# Altium project master-010106.PrjPcb (part 1 of 5)
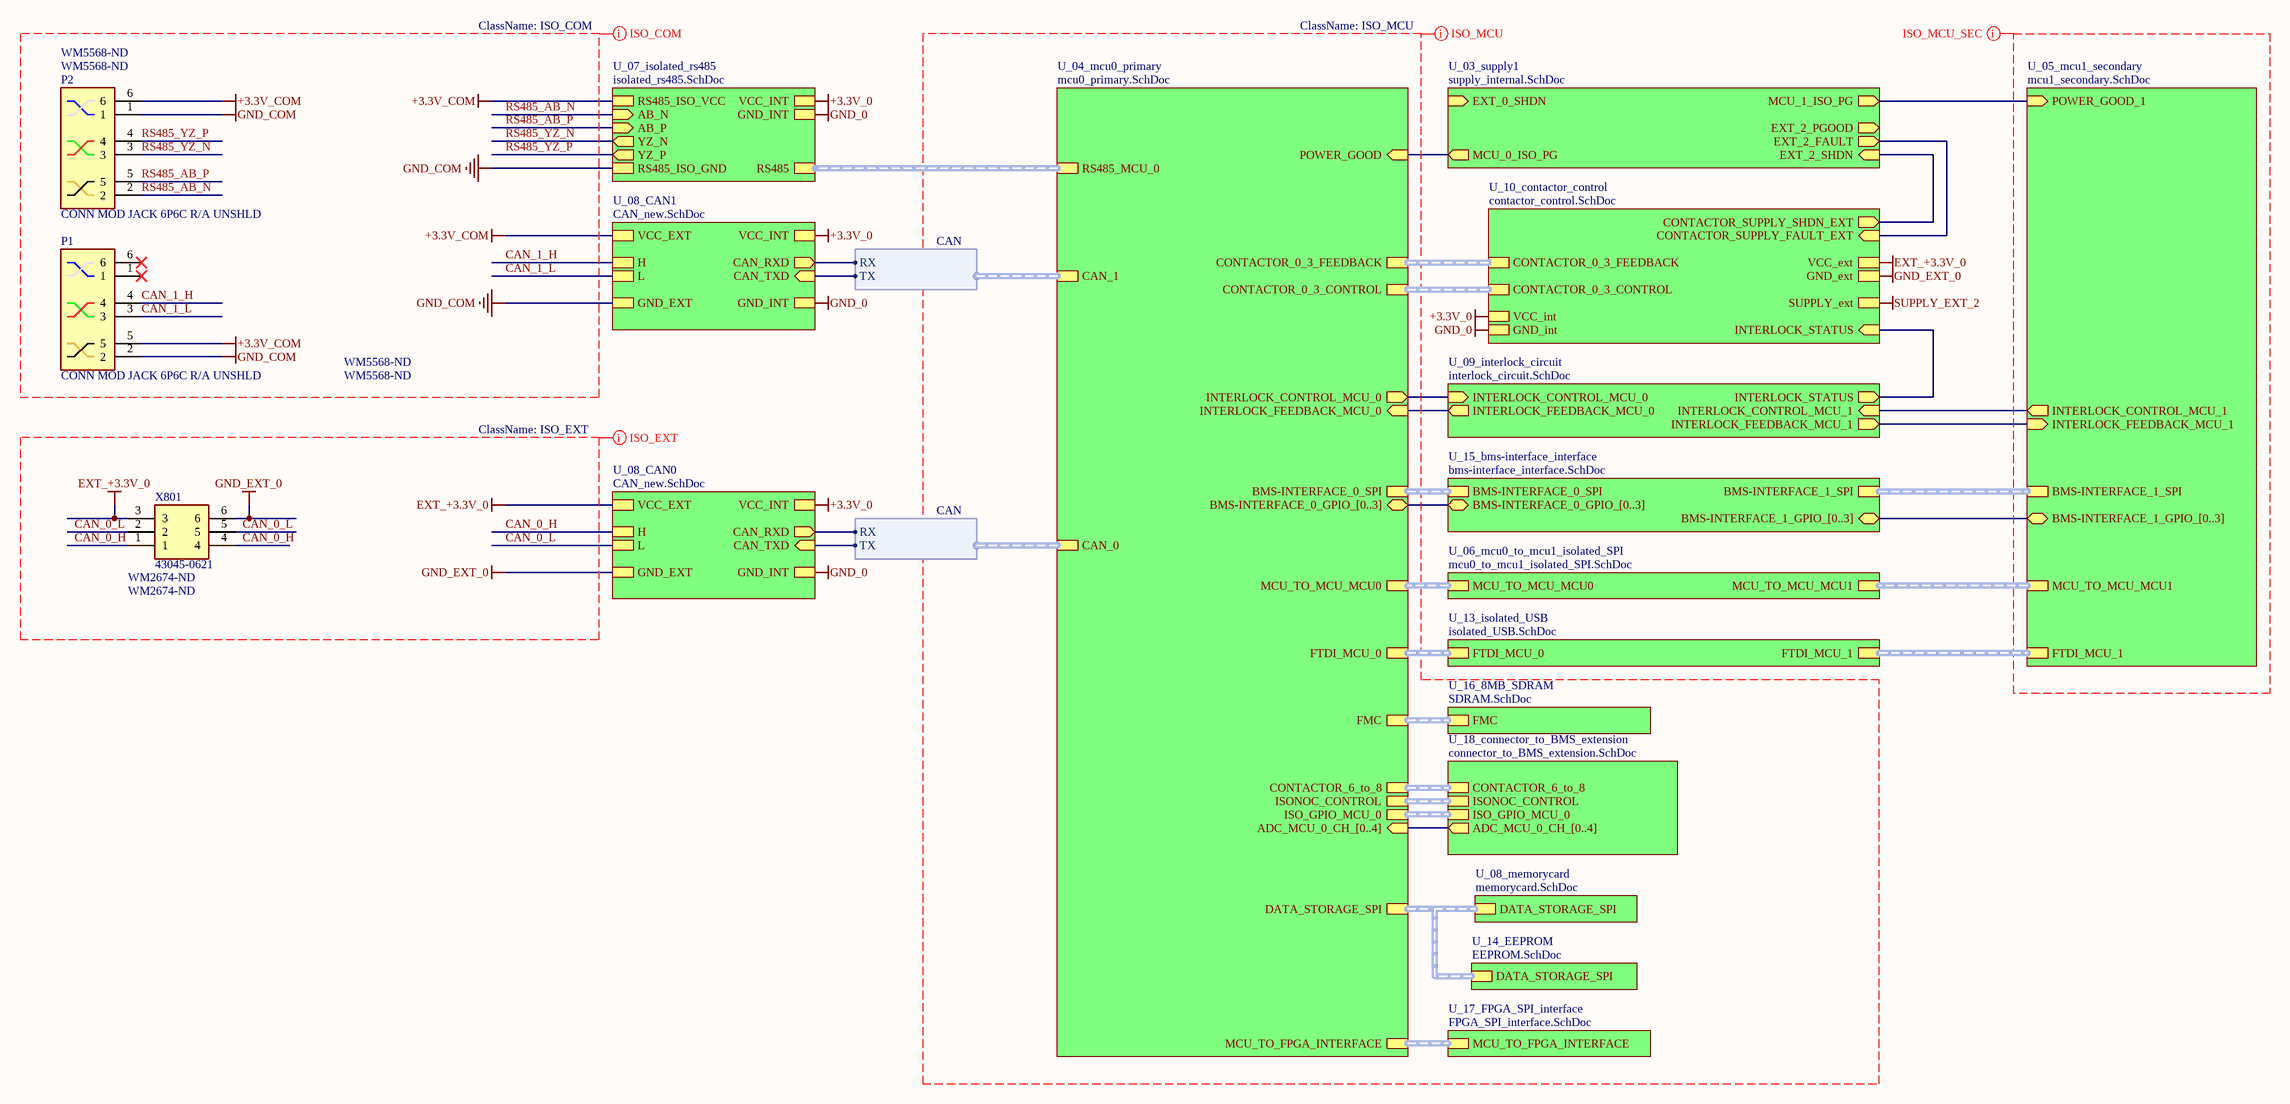
[diagram p0: hierarchy.SchDoc]
GlobalDate: 2019-07-15; GlobalLicense: Creative Commons Attribution 4.0; GlobalProject: foxBMS BMS-master; GlobalVersion: 1.0.6-1
28 sheets, 491 parts. Net scope: hierarchical (ports join the sheet entries above them; power ports are global).
Board files: master.PcbDoc, master-1X1.PcbDoc
Sheets:
  hierarchy.SchDoc
    U_17_FPGA_SPI_interface = FPGA_SPI_interface.SchDoc
    U_03_supply1 = supply_internal.SchDoc
      MCU_0_ISO = IsoDcDc-BSR033A.SchDoc
      MCU_1_ISO = IsoDcDc-BSR033A.SchDoc
      COM_EXT_ISO = isolated_dcdc_3.3to3.3.SchDoc
      MCU_0_VCC = dcdc_5v0_3v3.SchDoc
      EXT_SUPPLY_VCC = dcdc_wide_3v3.SchDoc
      MCU_1_VCC = dcdc_5v0_3v3.SchDoc
      EXT_SUPPLY = supply_external.SchDoc
    U_04_mcu0_primary = mcu0_primary.SchDoc
      U_0403_crystals = crystals.SchDoc
      U_0404_debug_LED = debug_LED.SchDoc
      U_0405_ext_bootload_activation = ext_bootload_activation.SchDoc
      U_0400_power = power.SchDoc
    U_16_8MB_SDRAM = SDRAM.SchDoc
    U_06_mcu0_to_mcu1_isolated_SPI = mcu0_to_mcu1_isolated_SPI.SchDoc
    U_05_mcu1_secondary = mcu1_secondary.SchDoc
    U_18_connector_to_BMS_extension = connector_to_BMS_extension.SchDoc
    U_09_interlock_circuit = interlock_circuit.SchDoc
    U_10_contactor_control = contactor_control.SchDoc
    U_14_EEPROM = EEPROM.SchDoc
    U_15_bms-interface_interface = bms-interface_interface.SchDoc
      Primary LTC6820 = 03_LTC6820.SchDoc
        U_0301_LTC6820_forward = 0301_LTC6820_chip.SchDoc
        U_0301_LTC6820_reverse = 0301_LTC6820_chip.SchDoc
      Secondary Galvanic Isolation = bms-slave-magnetics.SchDoc
      Secondary LTC6820 = 03_LTC6820.SchDoc
        U_0301_LTC6820_forward = 0301_LTC6820_chip.SchDoc
        U_0301_LTC6820_reverse = 0301_LTC6820_chip.SchDoc
    U_07_isolated_rs485 = isolated_rs485.SchDoc
    U_08_memorycard = memorycard.SchDoc
    U_08_CAN1 = CAN_new.SchDoc
    U_08_CAN0 = CAN_new.SchDoc
  isolated_usb_single.SchDoc

## Sheet hierarchy.SchDoc
size A2; DocumentNumber: 1; SheetNumber: 1; SheetTotal: 24; SheetDescription: Structure of Master

### Parts
P1  CONN MOD JACK 6P6C R/A UNSHLD  Supplier Part Number 1: WM5568-ND  [95501-2661]
P2  CONN MOD JACK 6P6C R/A UNSHLD  Supplier Part Number 1: WM5568-ND  [95501-2661]
X801  43045-0621  Supplier Part Number 1: WM2674-ND  [43045-0621]

### Sub-sheets
U_03_supply1 = supply_internal.SchDoc: EXT_2_FAULT (out), MCU_1_ISO_PG (out), EXT_0_SHDN (in), EXT_2_PGOOD (out), EXT_2_SHDN (in), MCU_0_ISO_PG (out)
U_04_mcu0_primary = mcu0_primary.SchDoc: MCU_TO_FPGA_INTERFACE (harness SPI), FMC (harness FMC), CAN_1 (harness CAN), CAN_0 (harness CAN), MCU_TO_MCU_MCU0 (harness SPI), FTDI_MCU_0 (harness FTDI), CONTACTOR_6_to_8 (harness CONTACTOR_6_to_8), INTERLOCK_FEEDBACK_MCU_0 (in), INTERLOCK_CONTROL_MCU_0 (out), DATA_STORAGE_SPI (harness DATA_STORAGE_SPI), CONTACTOR_0_3_CONTROL (harness CONTACTOR_0_TO_3), CONTACTOR_0_3_FEEDBACK (harness CONTACTOR_0_TO_3_FEEDBACK), BMS-INTERFACE_0_SPI (harness SPI), BMS-INTERFACE_0_GPIO_[0..3] (bidir, harness CAN), ADC_MCU_0_CH_[0..4] (in), RS485_MCU_0 (harness RS485), ISONOC_CONTROL (harness ISONOC_CONTROL), ISO_GPIO_MCU_0 (harness ISO_GPIO), POWER_GOOD (in)
U_05_mcu1_secondary = mcu1_secondary.SchDoc: INTERLOCK_FEEDBACK_MCU_1 (in), INTERLOCK_CONTROL_MCU_1 (out), FTDI_MCU_1 (harness FTDI), MCU_TO_MCU_MCU1 (harness SPI), BMS-INTERFACE_1_SPI (harness SPI), BMS-INTERFACE_1_GPIO_[0..3] (bidir), POWER_GOOD_1 (in)
U_06_mcu0_to_mcu1_isolated_SPI = mcu0_to_mcu1_isolated_SPI.SchDoc: MCU_TO_MCU_MCU0 (harness SPI), MCU_TO_MCU_MCU1 (harness SPI)
U_07_isolated_rs485 = isolated_rs485.SchDoc: RS485 (harness RS485), RS485_ISO_GND, RS485_ISO_VCC, YZ_P (out), AB_N (in), AB_P (in), YZ_N (out), VCC_INT, GND_INT
U_08_CAN0 = CAN_new.SchDoc: VCC_EXT, H, L, GND_EXT, CAN_TXD (in), CAN_RXD (out), GND_INT, VCC_INT
U_08_CAN1 = CAN_new.SchDoc: VCC_EXT, H, L, GND_EXT, CAN_TXD (in), CAN_RXD (out), GND_INT, VCC_INT
U_08_memorycard = memorycard.SchDoc: DATA_STORAGE_SPI (harness DATA_STORAGE_SPI)
U_09_interlock_circuit = interlock_circuit.SchDoc: INTERLOCK_CONTROL_MCU_1 (in), INTERLOCK_FEEDBACK_MCU_0 (out), INTERLOCK_FEEDBACK_MCU_1 (out), INTERLOCK_CONTROL_MCU_0 (in), INTERLOCK_STATUS (out)
U_10_contactor_control = contactor_control.SchDoc: SUPPLY_ext, GND_ext, GND_int, VCC_int, VCC_ext, CONTACTOR_0_3_CONTROL (harness CONTACTOR_0_TO_3), CONTACTOR_0_3_FEEDBACK (harness CONTACTOR_0_TO_3_FEEDBACK), CONTACTOR_SUPPLY_FAULT_EXT (in), CONTACTOR_SUPPLY_SHDN_EXT (out), INTERLOCK_STATUS (in)
U_13_isolated_USB = isolated_USB.SchDoc (file not in this document): FTDI_MCU_0 (harness FTDI), FTDI_MCU_1 (harness FTDI)
U_14_EEPROM = EEPROM.SchDoc: DATA_STORAGE_SPI (harness DATA_STORAGE_SPI)
U_15_bms-interface_interface = bms-interface_interface.SchDoc: BMS-INTERFACE_0_SPI (harness SPI), BMS-INTERFACE_1_SPI (harness SPI), BMS-INTERFACE_0_GPIO_[0..3] (bidir), BMS-INTERFACE_1_GPIO_[0..3] (bidir)
U_16_8MB_SDRAM = SDRAM.SchDoc: FMC (harness FMC)
U_17_FPGA_SPI_interface = FPGA_SPI_interface.SchDoc: MCU_TO_FPGA_INTERFACE (harness SPI)
U_18_connector_to_BMS_extension = connector_to_BMS_extension.SchDoc: CONTACTOR_6_to_8 (harness CONTACTOR_6_to_8), ADC_MCU_0_CH_[0..4] (out), ISONOC_CONTROL (harness ISONOC_CONTROL), ISO_GPIO_MCU_0 (harness ISO_GPIO)

### Harnesses
CAN: RX, TX

### Nets
+3.3V_0: sheet U_10_contactor_control/VCC_int, sheet U_07_isolated_rs485/VCC_INT, sheet U_08_CAN1/VCC_INT, sheet U_08_CAN0/VCC_INT
+3.3V_COM: P1.5 P2.6 X801.3 ; sheet U_10_contactor_control/VCC_ext, sheet U_07_isolated_rs485/RS485_ISO_VCC, sheet U_08_CAN1/VCC_EXT, sheet U_08_CAN0/VCC_EXT  [also labelled EXT_+3.3V_0]
GND_0: P1.2 P2.1 X801.6 ; sheet U_10_contactor_control/GND_ext, sheet U_10_contactor_control/GND_int, sheet U_07_isolated_rs485/RS485_ISO_GND, sheet U_07_isolated_rs485/GND_INT, sheet U_08_CAN1/GND_EXT, sheet U_08_CAN1/GND_INT, sheet U_08_CAN0/GND_EXT, sheet U_08_CAN0/GND_INT  [also labelled GND_COM, GND_EXT_0]  [project net GND]
CAN_0_H: X801.1 X801.4 ; sheet U_08_CAN0/H
CAN_0_L: X801.2 X801.5 ; sheet U_08_CAN0/L
CAN_0_RX: sheet U_08_CAN0/CAN_RXD, sheet U_04_mcu0_primary/CAN_0.RX
CAN_0_TX: sheet U_08_CAN0/CAN_TXD, sheet U_04_mcu0_primary/CAN_0.TX
CAN_1_H: P1.4 ; sheet U_08_CAN1/H
CAN_1_L: P1.3 ; sheet U_08_CAN1/L
CAN_1_RX: sheet U_08_CAN1/CAN_RXD, sheet U_04_mcu0_primary/CAN_1.RX
CAN_1_TX: sheet U_08_CAN1/CAN_TXD, sheet U_04_mcu0_primary/CAN_1.TX
CONTACTOR_SUPPLY_FAULT_EXT: sheet U_03_supply1/EXT_2_FAULT, sheet U_10_contactor_control/CONTACTOR_SUPPLY_FAULT_EXT
CONTACTOR_SUPPLY_SHDN_EXT: sheet U_03_supply1/EXT_2_SHDN, sheet U_10_contactor_control/CONTACTOR_SUPPLY_SHDN_EXT
INTERLOCK_CONTROL_MCU_0: sheet U_04_mcu0_primary/INTERLOCK_CONTROL_MCU_0, sheet U_09_interlock_circuit/INTERLOCK_CONTROL_MCU_0
INTERLOCK_CONTROL_MCU_1: sheet U_05_mcu1_secondary/INTERLOCK_CONTROL_MCU_1, sheet U_09_interlock_circuit/INTERLOCK_CONTROL_MCU_1
INTERLOCK_FEEDBACK_MCU_0: sheet U_04_mcu0_primary/INTERLOCK_FEEDBACK_MCU_0, sheet U_09_interlock_circuit/INTERLOCK_FEEDBACK_MCU_0
INTERLOCK_FEEDBACK_MCU_1: sheet U_05_mcu1_secondary/INTERLOCK_FEEDBACK_MCU_1, sheet U_09_interlock_circuit/INTERLOCK_FEEDBACK_MCU_1
INTERLOCK_STATUS: sheet U_09_interlock_circuit/INTERLOCK_STATUS, sheet U_10_contactor_control/INTERLOCK_STATUS
MCU_0_NRESET: sheet U_03_supply1/MCU_0_ISO_PG, sheet U_04_mcu0_primary/POWER_GOOD
MCU_1_NRESET: sheet U_03_supply1/MCU_1_ISO_PG, sheet U_05_mcu1_secondary/POWER_GOOD_1
RS485_AB_N: P2.2 ; sheet U_07_isolated_rs485/AB_N  [project net ABEXT_N]
RS485_AB_P: P2.5 ; sheet U_07_isolated_rs485/AB_P  [project net ABEXT_P]
RS485_YZ_N: P2.3 ; sheet U_07_isolated_rs485/YZ_N
RS485_YZ_P: P2.4 ; sheet U_07_isolated_rs485/YZ_P

Not connected (* = marked no-connect by the designer): P1 1* 6*

### Buses and harness runs
bus sheet U_04_mcu0_primary/ADC_MCU_0_CH_[0..4] = sheet U_18_connector_to_BMS_extension/ADC_MCU_0_CH_[0..4]
bus sheet U_05_mcu1_secondary/BMS-INTERFACE_1_GPIO_[0..3] = sheet U_15_bms-interface_interface/BMS-INTERFACE_1_GPIO_[0..3]
harness sheet U_04_mcu0_primary/BMS-INTERFACE_0_SPI = sheet U_15_bms-interface_interface/BMS-INTERFACE_0_SPI
harness sheet U_04_mcu0_primary/CONTACTOR_0_3_CONTROL = sheet U_10_contactor_control/CONTACTOR_0_3_CONTROL
harness sheet U_04_mcu0_primary/CONTACTOR_0_3_FEEDBACK = sheet U_10_contactor_control/CONTACTOR_0_3_FEEDBACK
harness sheet U_04_mcu0_primary/CONTACTOR_6_to_8 = sheet U_18_connector_to_BMS_extension/CONTACTOR_6_to_8
harness sheet U_04_mcu0_primary/DATA_STORAGE_SPI = sheet U_08_memorycard/DATA_STORAGE_SPI = sheet U_14_EEPROM/DATA_STORAGE_SPI
harness sheet U_04_mcu0_primary/FMC = sheet U_16_8MB_SDRAM/FMC
harness sheet U_04_mcu0_primary/FTDI_MCU_0 = sheet U_13_isolated_USB/FTDI_MCU_0
harness sheet U_04_mcu0_primary/ISO_GPIO_MCU_0 = sheet U_18_connector_to_BMS_extension/ISO_GPIO_MCU_0
harness sheet U_04_mcu0_primary/ISONOC_CONTROL = sheet U_18_connector_to_BMS_extension/ISONOC_CONTROL
harness sheet U_04_mcu0_primary/MCU_TO_FPGA_INTERFACE = sheet U_17_FPGA_SPI_interface/MCU_TO_FPGA_INTERFACE
harness sheet U_04_mcu0_primary/MCU_TO_MCU_MCU0 = sheet U_06_mcu0_to_mcu1_isolated_SPI/MCU_TO_MCU_MCU0
harness sheet U_04_mcu0_primary/RS485_MCU_0 = sheet U_07_isolated_rs485/RS485
harness sheet U_05_mcu1_secondary/BMS-INTERFACE_1_SPI = sheet U_15_bms-interface_interface/BMS-INTERFACE_1_SPI
harness sheet U_05_mcu1_secondary/FTDI_MCU_1 = sheet U_13_isolated_USB/FTDI_MCU_1
harness sheet U_05_mcu1_secondary/MCU_TO_MCU_MCU1 = sheet U_06_mcu0_to_mcu1_isolated_SPI/MCU_TO_MCU_MCU1

### Layout directives
net class ISO_MCU: +3.3V_0, EXT_+3.3V_0, GND_0, GND_EXT_0, SUPPLY_EXT_2
net class ISO_MCU_SEC: (no net found under the mark)
net class ISO_COM: +3.3V_COM, CAN_1_H, CAN_1_L, GND_COM, RS485_AB_N, RS485_AB_P, RS485_YZ_N, RS485_YZ_P
net class ISO_EXT: CAN_0_H, CAN_0_L, EXT_+3.3V_0, GND_EXT_0

### Notes on the sheet
- Title
- Size:
- Date:
- File:
- A2
- Number:
- Time:
- Revision:
- Sheet
- of

### Library data of the parts
P1 P2 = 95501-2661: Jack Modular Connector 6p6c (RJ9, RJ10, RJ22) 90° Angle (Right) Unshielded Cat3; Manufacturer_Name: Molex; Manufacturer_Part_Number: 95501-2441; Allied_Number: 70372436; Datasheet Link: http://www.molex.com/webdocs/datasheets/pdf/en-us/0955012441_MODULAR_JACKS_PLUG.pdf; Mouser Part Number: 538-95501-2441; Mouser Price/Stock: https://www.mouser.com/Search/Refine.aspx?Keyword=538-95501-2441; RS Part Number: 2400913; RS Price/Stock: https://uk.rs-online.com/web/p/products/2400913; Allied Price/Stock: http://www.alliedelec.com/molex-incorporated-95501-2441/70372436/; Supplier 1: Digi-Key; Supplier 2: Digi-Key; Supplier Part Number 2: WM5568-ND
X801 = 43045-0621: Micro-Fit 3.0 Right Angle Header, 3.00mm Pitch, Dual Row, 6 Circuits, with Snap-in Plastic Peg PCB Lock, Tin, Glow Wire Capable, Black, 43045-0621; Manufacturer_Name: Molex; Part Name: MicroFit; Circuits: 6; Datasheet Link: http://www.molex.com/webdocs/datasheets/pdf/en-us//0430450621_PCB_HEADERS.pdf; Height: 8mm; Manufacturer_Part_Number: 43045-0621; Mouser Part Number: 538-43045-0621; Mouser Price/Stock: https://www.mouser.com/Search/Refine.aspx?Keyword=538-43045-0621; RS Part Number: 6700380; RS Price/Stock: https://uk.rs-online.com/web/p/products/6700380; Supplier 1: Digi-Key; Supplier 2: Digi-Key; Supplier Part Number 2: WM2674-ND

## Sheet FPGA_SPI_interface.SchDoc: foxBMS BMS-Master
size A3; DocumentNumber: 23; SheetNumber: 23; SheetTotal: 24; Author: Fraunhofer IISB foxBMS Team; REL-DATE: 2017-05-16; VERSION: 1.0.2; SheetDescription: FPGA SPI Interface up to 45MHz
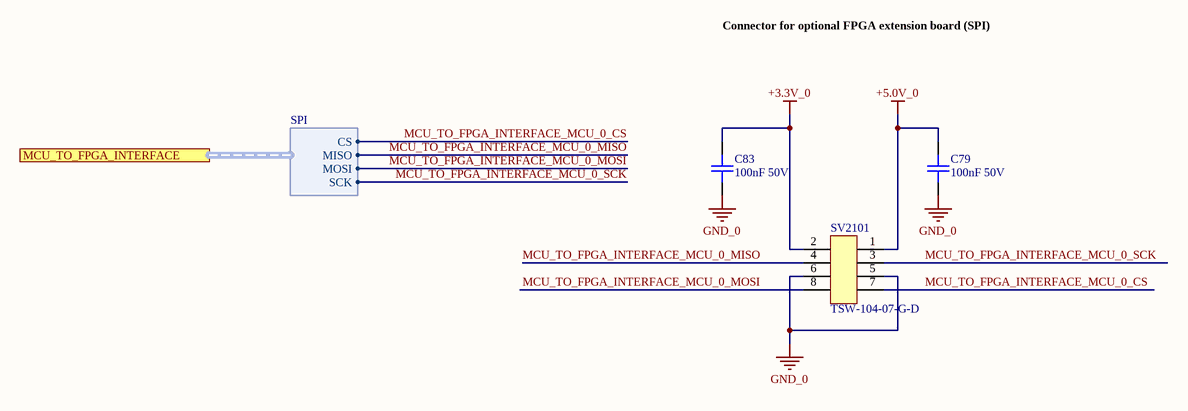
[diagram p1: FPGA_SPI_interface.SchDoc]

### Parts
C79  100nF 50V  [0603C]
C83  100nF 50V  [0603C]
SV2101  TSW-104-07-G-D  [Pinheader_2.54_2x4]

### Ports
MCU_TO_FPGA_INTERFACE (harness SPI)

### Harnesses
SPI: CS, MISO, MOSI, SCK

### Nets
+3.3V_0: C83.2 SV2101.2
+5.0V_0: C79.1 SV2101.1
GND_0: C79.2 C83.1 SV2101.5 SV2101.6  [project net GND]
MCU_TO_FPGA_INTERFACE_MCU_0_CS: SV2101.7 ; port MCU_TO_FPGA_INTERFACE.CS
MCU_TO_FPGA_INTERFACE_MCU_0_MISO: SV2101.4 ; port MCU_TO_FPGA_INTERFACE.MISO
MCU_TO_FPGA_INTERFACE_MCU_0_MOSI: SV2101.8 ; port MCU_TO_FPGA_INTERFACE.MOSI
MCU_TO_FPGA_INTERFACE_MCU_0_SCK: SV2101.3 ; port MCU_TO_FPGA_INTERFACE.SCK

### Notes on the sheet
- Connector for optional FPGA extension board (SPI)
- Fraunhofer IISB
- Schottkystr. 10
- developed by:
- 91058 Erlangen
- Germany
- Author
- Project
- License
- Description
- File
- Version
- Release Date
- Sheet
- www.foxbms.org
- www.iisb.fraunhofer.de
- foxBMS Team
- /

### Library data of the parts
C79 C83 = gen_C_ceramic_100n_50V_X7R_0603: Ceramic, 100nF, ±10%, 50V, X7R, –55 to 125°C, 0603 (1608),RoHS, Automotive; Part Number: GCJ188R71H104KA12; Manufacturer: Murata; Capacitance: 100n; Case EIA: 0603; Case Metric: 1608; PnP Package: C_0603_10; PnP Value: 100nF/50V/X7R; PnP equipped: x; Automotive Qualified: True; Rated Voltage: 50V; Dielectric: X7R; Supplier 1: Digi-Key; Supplier Part Number 1: 490-5798-1-ND; Height - Seated (Max): 0.8mm; Mounting Type: SurfaceMount,MLCC; Operating Temperature: –55 to 125°C; Series: GCJ; Tolerance: ±10%; Manufacturer_Part_Number: GCJ188R71H104KA12
SV2101 = samtec_TSW-104-07-G-D: Board-To-Board Connector, Vertical, 2.54 mm, 8 Contacts, Header, TSW Series, Through Hole, 2 Rows; Manufacturer: Samtec; Circuits: 8; Rated Voltage: 500V AC mated with SSW; Automotive Qualified: False; Part Number: TSW-104-07-G-D; Part Name: TSW-104-07-G-D; Operating Temperature: -55°C - +125°C; ComponentLink1Description: Datasheet; ComponentLink1URL: http://www.farnell.com/datasheets/1992055.pdf; Supplier 1: Farnell; Supplier Part Number 1: 2025250; System: Connector

## Sheet supply_internal.SchDoc: foxBMS BMS-Master
size A3; DocumentNumber: 3; SheetNumber: 3; SheetTotal: 24; Author: Fraunhofer IISB foxBMS Team; REL-DATE: 2017-05-16; VERSION: 1.0.2; SheetDescription: Supply for MCU1 and peripherals
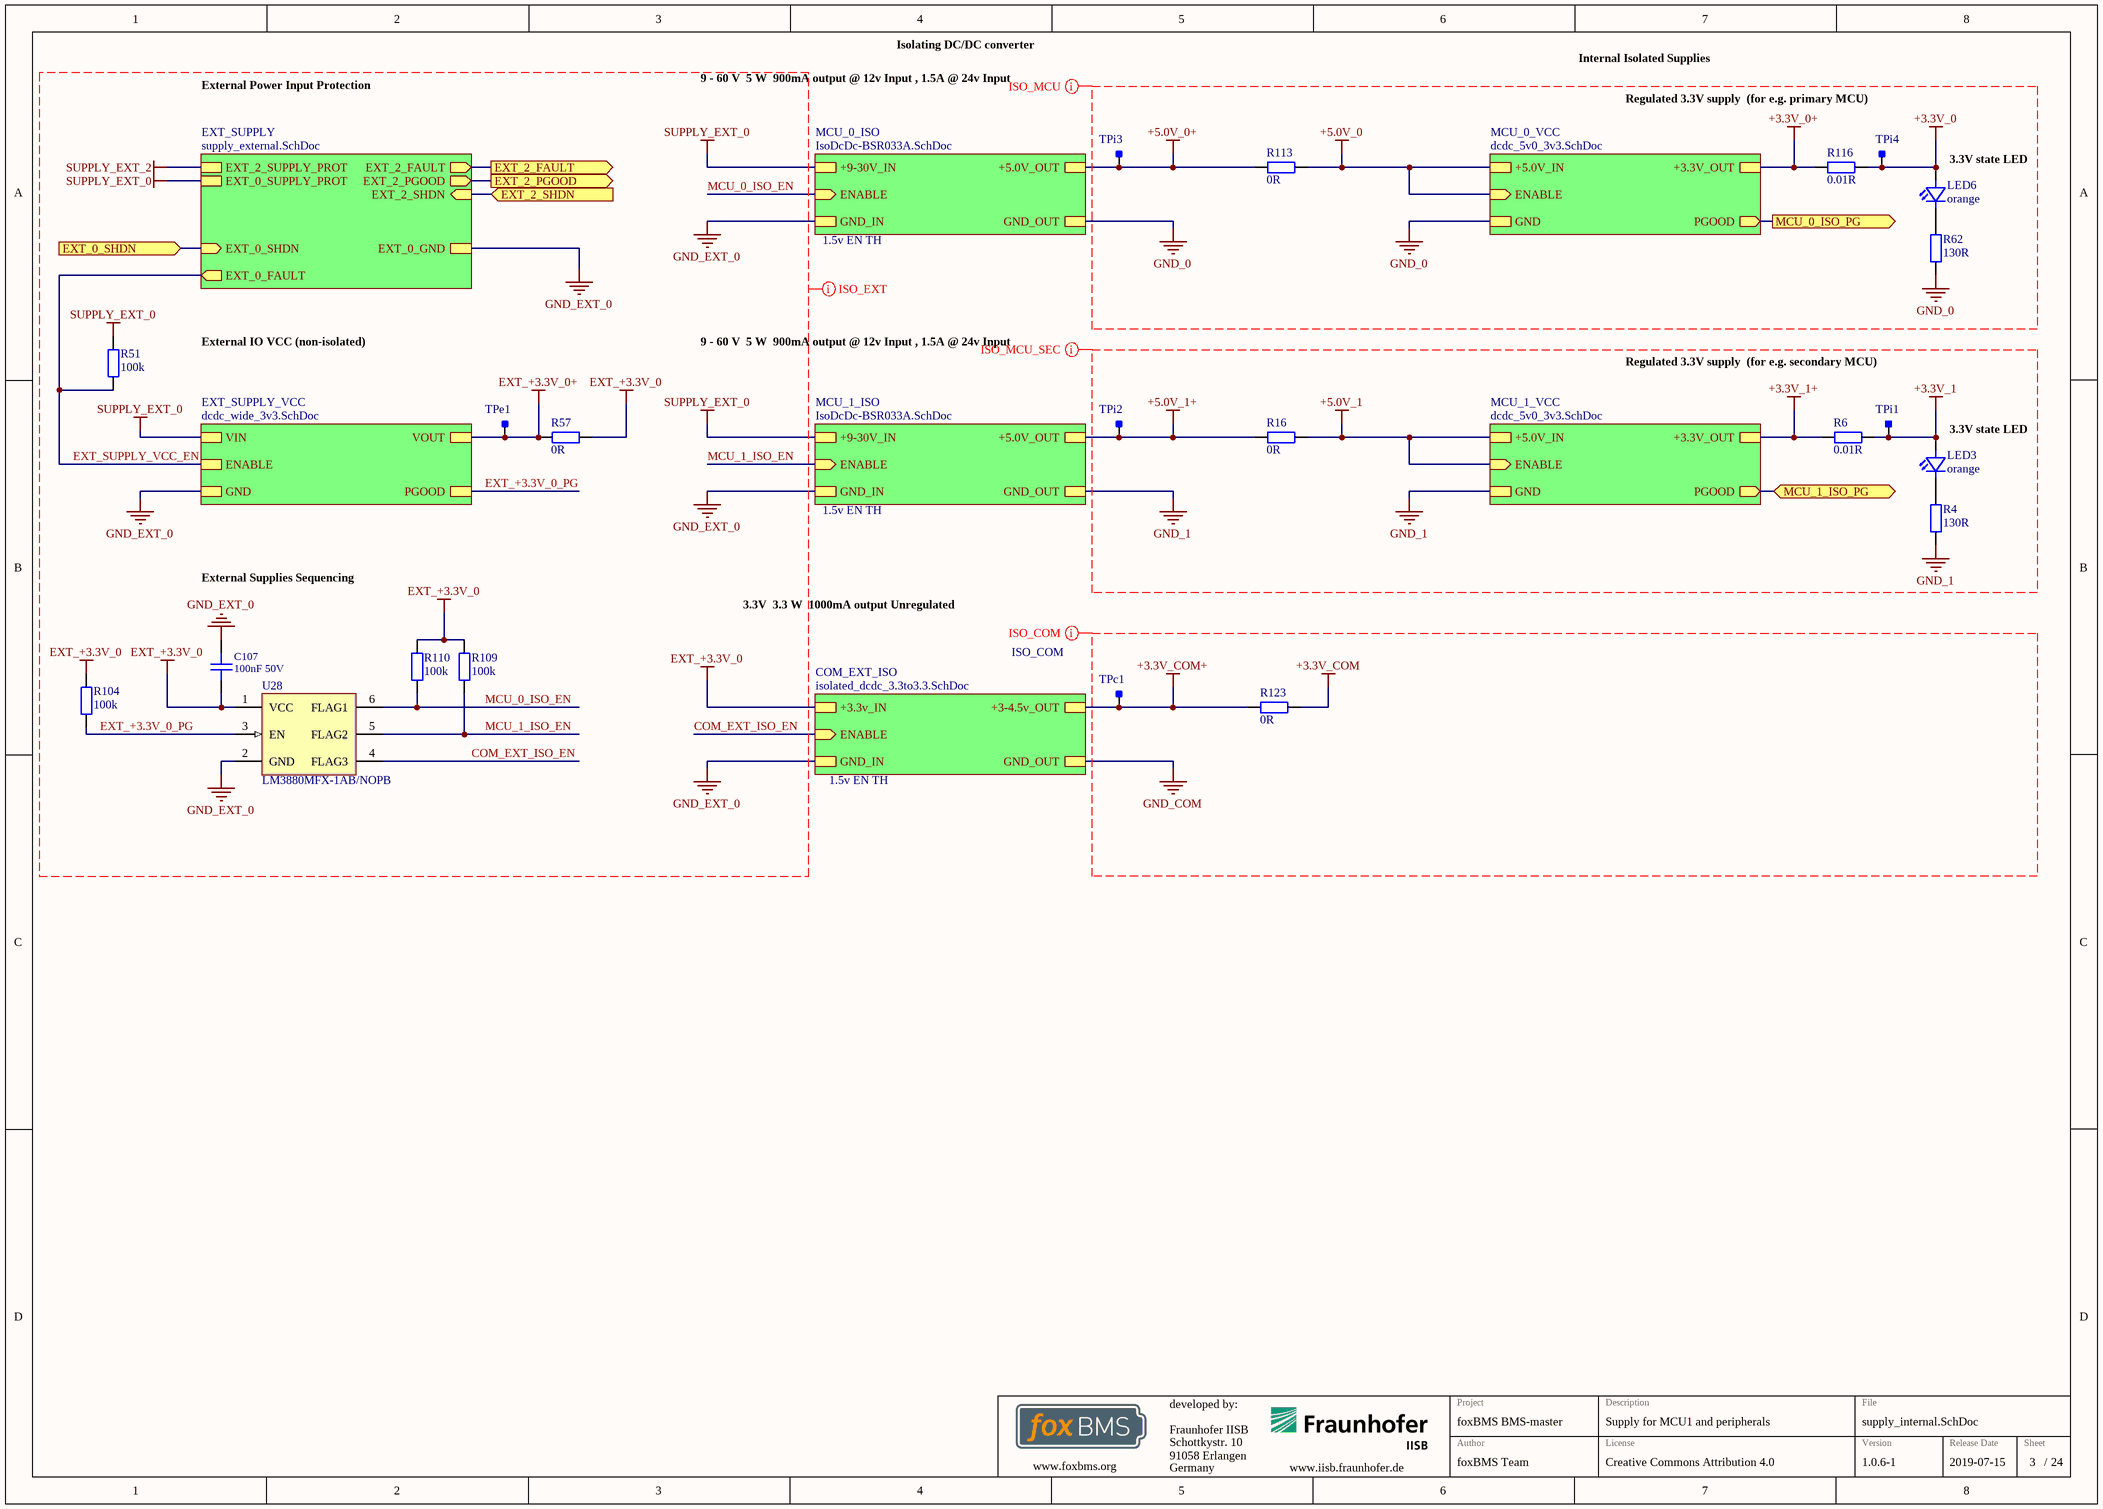
[diagram p2: supply_internal.SchDoc]

### Parts
(Parts that share a designator on the sheet are numbered #1, #2 ... from top to bottom, then left to right.)
C107  100nF 50V  [0603C]
LED3  orange  [LEDC1608X07N]
LED6  orange  [LEDC1608X07N]
R4#1  130R  [0603R]
R6  0.01R  [0805R]
R16  0R  [0805R]
R51#1  100k  [0402R]
R57  0R  [0805R]
R62#1  130R  [0603R]
R104  100k  [0603R]
R109  100k  [0603R]
R110  100k  [0603R]
R113  0R  [0805R]
R116  0.01R  [0805R]
R123  0R  [0805R]
TPc1  Testpoint_Square  [Testpoint_S1]  (value not drawn)  (no BOM)
TPe1  Testpoint_Square  [Testpoint_S1]  (value not drawn)  (no BOM)
TPi1  Testpoint_Square  [Testpoint_S1]  (value not drawn)  (no BOM)
TPi2  Testpoint_Square  [Testpoint_S1]  (value not drawn)  (no BOM)
TPi3  Testpoint_Square  [Testpoint_S1]  (value not drawn)  (no BOM)
TPi4  Testpoint_Square  [Testpoint_S1]  (value not drawn)  (no BOM)
U28  LM3880MFX-1AB/NOPB  [MF06A_N]

### Sub-sheets
COM_EXT_ISO = isolated_dcdc_3.3to3.3.SchDoc: ENABLE (in), +3.3v_IN, GND_OUT, +3-4.5v_OUT, GND_IN
EXT_SUPPLY = supply_external.SchDoc: EXT_2_FAULT (out), EXT_2_PGOOD (out), EXT_0_FAULT (out), EXT_2_SHDN (in), EXT_0_SHDN (in), EXT_2_SUPPLY_PROT, EXT_0_SUPPLY_PROT, EXT_0_GND
EXT_SUPPLY_VCC = dcdc_wide_3v3.SchDoc: VIN, ENABLE, PGOOD, GND, VOUT
MCU_0_ISO = IsoDcDc-BSR033A.SchDoc: ENABLE (in), +9-30V_IN, +5.0V_OUT, GND_OUT, GND_IN
MCU_0_VCC = dcdc_5v0_3v3.SchDoc: +5.0V_IN, ENABLE (in), PGOOD (out), GND, +3.3V_OUT
MCU_1_ISO = IsoDcDc-BSR033A.SchDoc: ENABLE (in), +9-30V_IN, +5.0V_OUT, GND_OUT, GND_IN
MCU_1_VCC = dcdc_5v0_3v3.SchDoc: +5.0V_IN, ENABLE (in), PGOOD (out), GND, +3.3V_OUT

### Ports
EXT_0_SHDN (in), EXT_2_FAULT (out), EXT_2_PGOOD (out), EXT_2_SHDN (in), MCU_0_ISO_PG (out), MCU_1_ISO_PG (bidir)

### Nets
+3.3V_0: LED3.2(A) LED6.2(A) R6.1 R116.1 TPi1.1 TPi4.1  [also labelled +3.3V_1]
+3.3V_0+: R116.2 ; sheet MCU_0_VCC/+3.3V_OUT
+3.3V_1+: R6.2 ; sheet MCU_1_VCC/+3.3V_OUT
+3.3V_COM: C107.2 R57.1 R104.2 R109.2 R110.2 R123.1 U28.1(VCC) ; sheet COM_EXT_ISO/+3.3v_IN  [also labelled EXT_+3.3V_0]
+3.3V_COM+: R123.2 TPc1.1 ; sheet COM_EXT_ISO/+3-4.5v_OUT  [project net +3-4.5v_out]
+5.0V_0: R113.1 ; sheet MCU_0_VCC/+5.0V_IN, sheet MCU_0_VCC/ENABLE
+5.0V_0+: R16.2 R113.2 TPi2.1 TPi3.1 ; sheet MCU_0_ISO/+5.0V_OUT, sheet MCU_1_ISO/+5.0V_OUT  [also labelled +5.0V_1+]
+5.0V_1: R16.1 ; sheet MCU_1_VCC/+5.0V_IN, sheet MCU_1_VCC/ENABLE
EXT_+3.3V_0+: R57.2 TPe1.1 ; sheet EXT_SUPPLY_VCC/VOUT
GND_0: C107.1 R4#1.2 R62#1.1 U28.2(GND) ; sheet MCU_0_ISO/GND_OUT, sheet MCU_0_ISO/GND_IN, sheet MCU_1_ISO/GND_OUT, sheet MCU_1_ISO/GND_IN, sheet COM_EXT_ISO/GND_OUT, sheet COM_EXT_ISO/GND_IN, sheet MCU_0_VCC/GND, sheet EXT_SUPPLY_VCC/GND, sheet MCU_1_VCC/GND, sheet EXT_SUPPLY/EXT_0_GND  [also labelled GND_1, GND_COM, GND_EXT_0]  [project net GND]
SUPPLY_EXT_0: R51#1.2 ; sheet MCU_0_ISO/+9-30V_IN, sheet MCU_1_ISO/+9-30V_IN, sheet EXT_SUPPLY_VCC/VIN, sheet EXT_SUPPLY/EXT_0_SUPPLY_PROT  [project net +9-30V_IN]
COM_EXT_ISO_EN: U28.4(FLAG3) ; sheet COM_EXT_ISO/ENABLE
CONTACTOR_SUPPLY_FAULT_EXT: port EXT_2_FAULT, sheet EXT_SUPPLY/EXT_2_FAULT
CONTACTOR_SUPPLY_SHDN_EXT: port EXT_2_SHDN, sheet EXT_SUPPLY/EXT_2_SHDN
EXT_0.SHDN: port EXT_0_SHDN, sheet EXT_SUPPLY/EXT_0_SHDN
EXT_2.PGOOD: port EXT_2_PGOOD, sheet EXT_SUPPLY/EXT_2_PGOOD
EXT_+3.3V_0_PG: R104.1 U28.3(EN) ; sheet EXT_SUPPLY_VCC/PGOOD
EXT_SUPPLY_VCC_EN: R51#1.1 ; sheet EXT_SUPPLY_VCC/ENABLE, sheet EXT_SUPPLY/EXT_0_FAULT  [project net EXT_0.FAULT]
MCU_0_ISO_EN: R110.1 U28.6(FLAG1) ; sheet MCU_0_ISO/ENABLE
MCU_0_NRESET: port MCU_0_ISO_PG, sheet MCU_0_VCC/PGOOD
MCU_1_ISO_EN: R109.1 U28.5(FLAG2) ; sheet MCU_1_ISO/ENABLE
MCU_1_NRESET: port MCU_1_ISO_PG, sheet MCU_1_VCC/PGOOD
NetLED3_1: LED3.1(C) R4#1.1
NetLED6_1: LED6.1(C) R62#1.2

### Layout directives
net class ISO_MCU_SEC: +3.3V_1, +3.3V_1+, +5.0V_1, +5.0V_1+, GND_1
net class ISO_EXT: COM_EXT_ISO_EN, EXT_+3.3V_0, EXT_+3.3V_0+, EXT_+3.3V_0_PG, EXT_SUPPLY_VCC_EN, GND_EXT_0, MCU_0_ISO_EN, MCU_1_ISO_EN, SUPPLY_EXT_0, SUPPLY_EXT_2
net class ISO_MCU: +3.3V_0, +3.3V_0+, +5.0V_0, +5.0V_0+, GND_0
net class ISO_COM: +3.3V_COM, +3.3V_COM+, GND_COM

### Notes on the sheet
- Isolating DC/DC converter
- External Power Input Protection
- 9 - 60 V
  5 W
  900mA output @ 12v Input , 1.5A @ 24v Input
- Internal Isolated Supplies
- Regulated 3.3V supply
  (for e.g. primary MCU)
- (near LED6) 3.3V state LED
- 1.5v EN TH
- External IO VCC (non-isolated)
- Regulated 3.3V supply
  (for e.g. secondary MCU)
- (near LED3) 3.3V state LED
- External Supplies Sequencing
- 3.3V
  3.3 W
  1000mA output Unregulated
- Fraunhofer IISB
- Schottkystr. 10
- developed by:
- 91058 Erlangen
- Germany
- Author
- Project
- License
- Description
- File
- Version
- Release Date
- Sheet
- www.foxbms.org
- www.iisb.fraunhofer.de
- foxBMS Team
- /

### Library data of the parts
C107 = gen_C_ceramic_100n_50V_X7R_0603: Ceramic, 100nF, ±10%, 50V, X7R, –55 to 125°C, 0603 (1608),RoHS, Automotive; Part Number: GCJ188R71H104KA12; Manufacturer: Murata; Capacitance: 100n; Case EIA: 0603; Case Metric: 1608; Automotive Qualified: True; PnP Package: C_0603_10; PnP Value: 100nF/50V/X7R; Dielectric: X7R; Rated Voltage: 50V; Height - Seated (Max): 0.8mm; Mounting Type: SurfaceMount,MLCC; Operating Temperature: –55 to 125°C; Series: GCJ; Tolerance: ±10%; Manufacturer_Part_Number: GCJ188R71H104KA12; Supplier 1: Digi-Key; Supplier Part Number 1: 490-5798-1-ND
LED3 LED6 = gen_LED_0603_orange: LED; Breakdown Voltage: 5V; Continuous Forward Current: 20mA; Forward Voltage @ 20mA: 2.2V; Automotive Qualified: False; Case EIA: 0603; Case Metric: 1608; Part Number: gen_LED_0603_orange; Color: orange; PnP Package: LED_0603; Supplier 1: Farnell; Supplier Part Number 1: 2099222
R4#1 R62#1 = gen_R_130R_0603: SMD Resistor 130R 0603; Tolerance: 1%; Power: 0.1W; Case EIA: 0603; Case Metric: 1608; Maximum Working Voltage: 75V; PnP Package: R_0603; Automotive Qualified: False; Part Number: gen_R_130R_0603; Operating Temperature: -55°C - +155°C; Resistance: 130R; Series: E24, E96; PnP Value: 130R; Supplier 1: Farnell; Supplier Part Number 1: 2379959
R6 R116 = gen_R_0.01R_0805: SMD Resistor 10m 0805; Case EIA: 0805; Case Metric: 2012; PnP Package: R_0603; Operating Temperature: -55°C - +155°C; PnP Value: 0.01R; Part Number: gen_R_0.01R_0805
R16 R57 R113 R123 = gen_R_0.01R_0805: SMD Resistor 10m 0805; Case EIA: 0805; Case Metric: 2012; PnP Package: R_0603; PnP Value: 0.01R; Operating Temperature: -55°C - +155°C; Part Number: gen_R_0.01R_0805
R51#1 = gen_R_100k_0402: SMD Resistor 100k 0402; Case EIA: 0402; Case Metric: 1005; PnP Package: R_0402; Automotive Qualified: False; PnP Value: 100k; Operating Temperature: -55°C - +155°C; Part Number: gen_R_100k_0402
R104 R109 R110 = gen_R_100k_0603: SMD Resistor 100k 0603; Case EIA: 0603; Case Metric: 1608; PnP Package: R_0603; Automotive Qualified: False; PnP Value: 100k; Operating Temperature: -55°C - +155°C; Part Number: gen_R_100k_0603
TPc1 TPe1 TPi1-TPi4 = Testpoint_Square: Testpoint, square; Part Number: Testpoint_Square
U28 = CMP-0063-01010-1: Power Sequencer, 6-pin SOT-23, Pb-Free; Manufacturer: National Semiconductor; CompType: MiscPower; PowerWise: N; PackageTopMarking: F21A*XTT; DatasheetVersion: May-2008; PinCount: 6; Code_JEDEC: MO-178-AB; PackageReference: MF06A; Code_IPC: SOT26A-6; RoHS: Y; PackageDescription: Molded SOT-23, .115 x .063 x .040in Body, 6 Lead, .0375in in Pitch; PackageVersion: revC, Sep-2005

## Sheet IsoDcDc-BSR033A.SchDoc: LM5180EVM-S05 Buck Converter Schematic
size 431 x 279 mm; Date: Not shown in title block; ApprovedBy: Not shown in title block; CheckedBy: Not shown in title block; Author: Not shown in title block; CompanyName: Not shown in title block; DrawnBy: K Nielson; Engineer: Not shown in title block; Organization: Not shown in title block; Address1: Not shown in title block; Address2: Not shown in title block; Address3: Not shown in title block; Address4: Not shown in title block; DocumentNumber: 1; Revision: Use project parameter SCH_Rev; SheetNumber: 1; SheetTotal: 2; PageSetup: Record=PageOptions|CenterHorizontal=True|CenterVertical=True|PrintScale=1.00|XCorrection=1.00|YCorrection=1.00|PrintKind=0|BorderSize=5000000|LeftOffset=0|BottomOffset=0|Orientation=2|PaperLength=1000|PaperWidth=1000|Scale=100|PaperSource=15|PrintQuality=600|MediaType=1|DitherType=10|PaperKind=Letter|PrintScaleMode=1; CurrentTime: Not shown in title block; CurrentDate: Not shown in title block; Time: Not shown in title block; DocumentFullPathAndName: Not shown in title block; DocumentName: Not shown in title block; ModifiedDate: Not shown in title block; ImagePath: Not shown in title block
Used 2 times, as channels U_03_supply1/MCU_0_ISO, U_03_supply1/MCU_1_ISO. Parts and nets are listed once, with the designators drawn on the sheet.
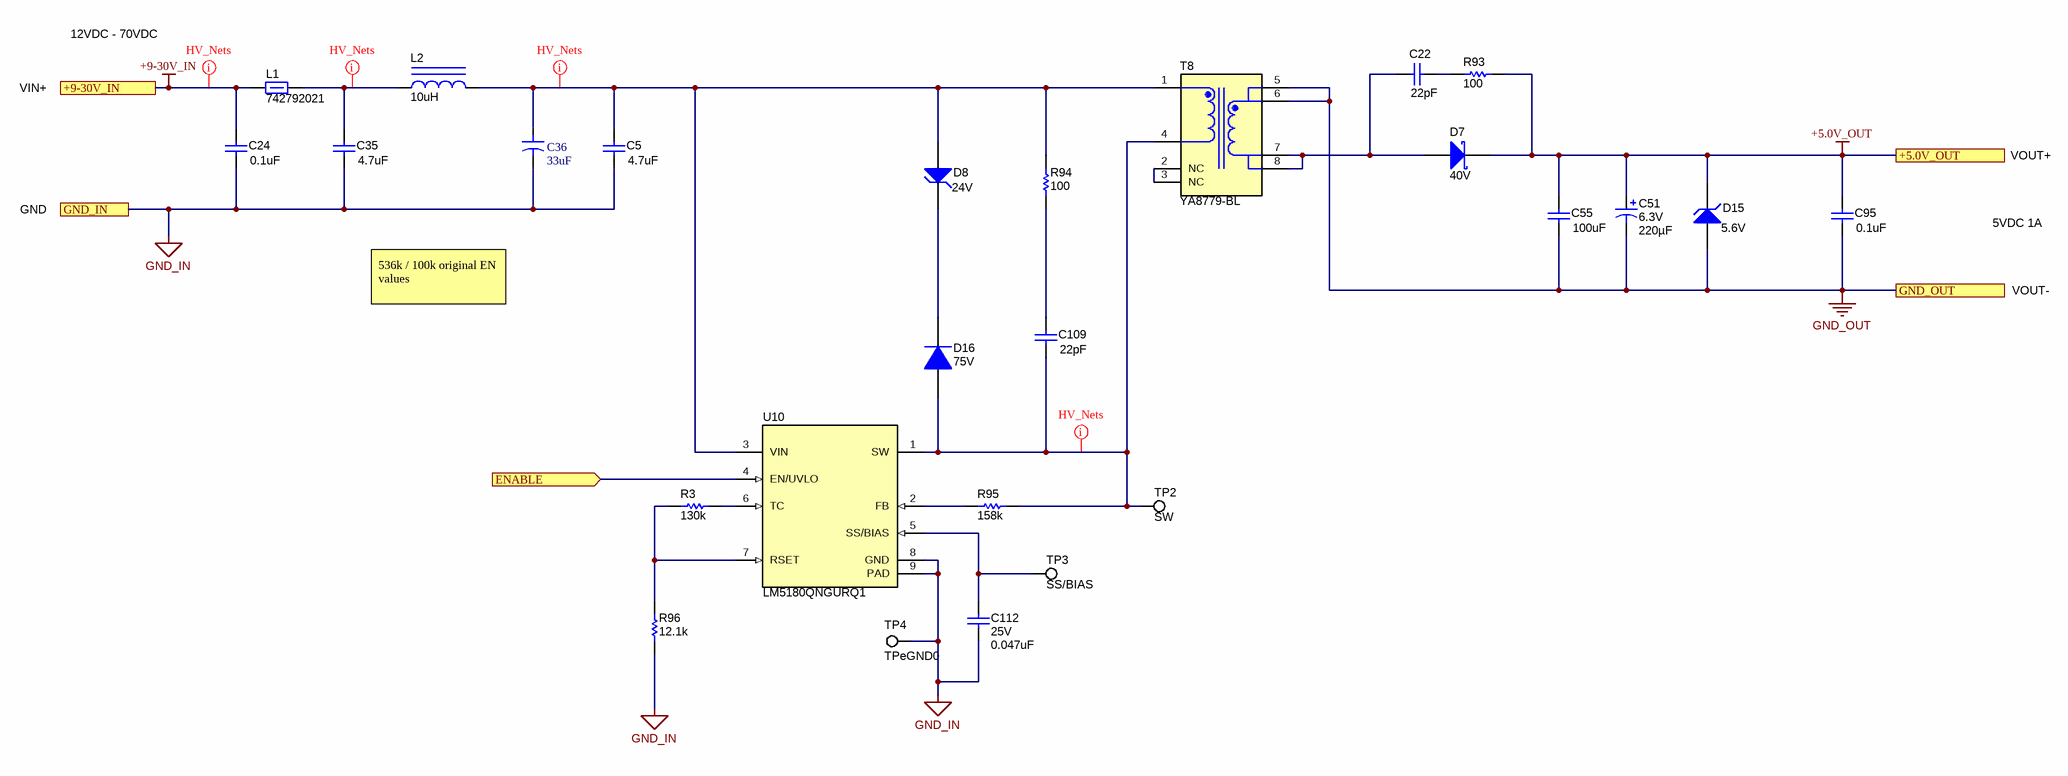
[diagram p3: IsoDcDc-BSR033A.SchDoc]

### Parts
C5  ValueDisplayed: 4.7uF  [1210C]  (hidden comment: GRM32DC72A475KE01L)
C22  ValueDisplayed: 22pF  [0603C]  (hidden comment: GRM1885C2A220JA01D)
C24  ValueDisplayed: 0.1uF  [0603C]  (hidden comment: GRM188R72A104KA35J)
C35  ValueDisplayed: 4.7uF  [1210C]  (hidden comment: GRM32DC72A475KE01L)
C36  value 33uF  [CAPC7343X430M]  (hidden comment: CAP TANTALUM 33UF 50V 2917)
C51  VDC_V: 6.3V  ValueDisplayed: 220µF  [7343-31]  (hidden comment: T598D107M010ATE025)
C55  ValueDisplayed: 100uF  [1210C]  (hidden comment: GRM32EC80J107ME20L)
C95  ValueDisplayed: 0.1uF  [0603C]  (hidden comment: GRM188R72A104KA35J)
C109  ValueDisplayed: 22pF  [0603C]  (hidden comment: GRM1885C2A220JA01D)
C112  VDC_V: 25V  ValueDisplayed: 0.047uF  [0603C]  (hidden comment: GCM188R71E473KA37D)
D7  40V  [SMAF]
D8  Vz_V: 24V  [PowerDI123]  (hidden comment: DFLZ24-7)
D15  Vz_V: 5.6V  [SOD-323]  (hidden comment: MMSZ5232BS-7-F)
D16  75V  [SOD-323]
L1  742792021  [0805_HV]
L2  ValueDisplayed: 10uH  [WE-TPC-M1]  (hidden comment: 744042100)
R3  ValueDisplayed: 130k  [0603R]  (hidden comment: CRCW0603130KFKEA)
R93  ValueDisplayed: 100  [0603R]  (hidden comment: CRCW0603100RFKEA)
R94  ValueDisplayed: 100  [0603R]  (hidden comment: CRCW0603100RFKEA)
R95  ValueDisplayed: 158k  [0603R]  (hidden comment: CRCW0603158KFKEA)
R96  ValueDisplayed: 12.1k  [0603R]  (hidden comment: CRCW060312K1FKEA)
T8  YA8779-BL  [Coilcraft_YA8779-CL]
TP2  SW  [Testpoint_Keystone_Miniature]
TP3  SS/BIAS  [Testpoint_Keystone_Miniature]
TP4  TPeGND0  [Testpoint_Keystone_Miniature]
U10  LM5180QNGURQ1  [NGU0008C]

### Ports
+5.0V_OUT, +9-30V_IN, ENABLE (in), GND_IN, GND_OUT

### Nets
+5.0V_OUT: C51.1(+) C55.1 C95.1 D7.1(K) D15.1(K) R93.1 ; port +5.0V_OUT
+9-30V_IN: C24.1 L1.1 ; port +9-30V_IN
GND_IN: C5.1 C24.2 C35.1 C36.2 C112.2 R96.1 TP4.1 U10.8(GND) U10.9(PAD) ; port GND_IN
GND_OUT: C51.2(-) C55.2 C95.2 D15.2(A) T8.5 T8.6 ; port GND_OUT
ENABLE: U10.4(EN/UVLO) ; port ENABLE
NetC5_2: C5.2 C36.1 D8.2(A) L2.2 R94.2 T8.1 U10.3(VIN)
NetC22_1: C22.1 R93.2
NetC22_2: C22.2 D7.2(A) T8.7 T8.8
NetC35_2: C35.2 L1.2 L2.1
NetC109_1: C109.1 R94.1
NetC109_2: C109.2 D16.2(A) R95.2 T8.4 TP2.1 U10.1(SW)
NetC112_1: C112.1 TP3.1 U10.5(SS/BIAS)
NetD8_1: D8.1(K) D16.1(K)
NetR3_1: R3.1 R96.2 U10.7(RSET)
NetR3_2: R3.2 U10.6(TC)
NetR95_1: R95.1 U10.2(FB)
NetT8_2: T8.2(NC) T8.3(NC)

### Channels
U_03_supply1/MCU_0_ISO: designators C5=C5_1 C22=C22_1 C24=C24_1 C35=C35_1 C36=C36_1 C51=C51_1 C55=C55_1 C95=C95_1 C109=C109_1 C112=C112_1 D7=D7_1 D8=D8_1 D15=D15_1 D16=D16_1 L1=L1_1 L2=L2_1 R3=R3_1 R93=R93_1 R94=R94_1 R95=R95_1 R96=R96_1 T8=T8_1 TP2=TP2_1#1 TP3=TP3_1#1 TP4=TP4_1#1 U10=U10_1; ports +5.0V_OUT=+5.0V_0+ +9-30V_IN=+9-30V_IN ENABLE=MCU_0_ISO_EN GND_IN=GND GND_OUT=GND
U_03_supply1/MCU_1_ISO: designators C5=C5_2 C22=C22_2 C24=C24_2 C35=C35_2 C36=C36_2 C51=C51_2 C55=C55_2 C95=C95_2 C109=C109_2 C112=C112_2 D7=D7_2 D8=D8_2 D15=D15_2 D16=D16_2 L1=L1_2 L2=L2_2 R3=R3_2 R93=R93_2 R94=R94_2 R95=R95_2 R96=R96_2 T8=T8_2 TP2=TP2_2#1 TP3=TP3_2#1 TP4=TP4_2#1 U10=U10_2; ports +5.0V_OUT=+5.0V_0+ +9-30V_IN=+9-30V_IN ENABLE=MCU_1_ISO_EN GND_IN=GND GND_OUT=GND

### Layout directives
net class HV_Nets: +9-30V_IN, NetC5_1_2, NetC35_1_2, NetC109_1_2

### Notes on the sheet
- 12VDC - 70VDC
- VIN+
- GND
- VOUT+
- 5VDC 1A
- 536k / 100k original EN values
- VOUT-
- Drawn By:
- SVN Rev:
- Number:
- TID #:
- Orderable:
- Rev:
- Sheet Title:
- File:
- Project Title:
- Designed for:
- Assembly Variant:
- Mod. Date:
- Sheet:
- Size:
- of
- B
- http://www.ti.com
- Texas Instruments and/or its licensors do not warrant the accuracy or completeness of this specification or any information contained therein. Texas Instruments and/or its licensors do not warrant that this design will meet the specifications, will be suitable for your application or fit for any particular purpose, or will operate in an implementation. Texas Instruments and/or its licensors do not warrant that the design is production worthy. You should completely validate and test your design implementation to confirm the system functionality for your application.
- Engineer:
- Contact:
- © Texas Instruments

### Library data of the parts
C5 C35 = CMP-0009182-2: CAP, CERM, 4.7 uF, 100 V, +/- 10%, X7S, 1210; Manufacturer: MuRata; TaMin_C: -55°C; Polarized: N; SizeAreaWB_mm2: 14.7; Value1: Unknown; U/M: EA; Value: 4.7uF; TaMax_C: 125°C; SizeZ_mm: 2.2; SizeX_mm: 3.2; SizeY_mm: 2.5; Cap_Case: 1210; Value2: 100V; SizeArea_mm2: 8; CompType: Capacitor; Cap_F: 4.7µF; AEC Category: Q200; Publisher: Texas Instruments; TempCo: X7S; Published: 2008-06-19; RoHS: Y; MountType: SMT; Supplier 1: Mouser; PackageReference: 1210; Tolerance_%: 10%; LatestRevisionDate: 2017-03-09; PartNumber: GRM32DC72A475KE01L; AEC Qualified: N; VDC_V: 100V; ComponentLink1Description: Datasheet link; AEC Grade: N/A; Supplier Part Number 1: 81-GRM32DC72A475KE1L; Technology: Ceramic; ComponentLink1URL: http://search.murata.co.jp/Ceramy/image/img/A01X/G101/ENG/GRM32DC72A475KE01-01.pdf
C22 = CMP-0007255-4: CAP, CERM, 22 pF, 100 V, +/- 5%, C0G/NP0, 0603; Manufacturer: MuRata; TaMin_C: -55°C; Polarized: N; SizeAreaWB_mm2: 4.68; U/M: EA; Value: 22pF; TaMax_C: 125°C; SizeZ_mm: 1; SizeX_mm: 1.6; SizeY_mm: 0.8; Cap_Case: 0603; Value2: 100V; SizeArea_mm2: 1.28; CompType: Capacitor; AEC Category: Q200; Value1: Unknown; ComponentLink1URL: http://search.murata.co.jp/Ceramy/PnsearchViewAction.do?HnOFG=ON&HnNFG=ON&SEL_CNT=50&sLang=en&sKey=GRM1885C2A220JA01D&x=9&y=9&search=startwith; Supplier Part Number 2: 81-GRM1885C2A220JA01; Supplier 2: Mouser; TempCo: C0G/NP0; RoHS: Y; MountType: SMT; Supplier 1: Digi-Key; PackageReference: 0603; Tolerance_%: 5%; PartNumber: GRM1885C2A220JA01D; AEC Qualified: ?; Cap_F: 22pF; VDC_V: 100V; ComponentLink1Description: Datasheet link; Supplier Part Number 1: 490-1335-1-ND; Technology: Ceramic; Publisher: Texas Instruments; Published: 2008-06-19; LatestRevisionDate: 2017-03-09
C24 C95 = CMP-0007470-5: CAP, CERM, 0.1 uF, 100 V, +/- 10%, X7R, 0603; Manufacturer: MuRata; TaMin_C: -55°C; Polarized: N; SizeAreaWB_mm2: 4.68; Value1: Unknown; U/M: EA; Value: 0.1uF; TaMax_C: 125°C; SizeZ_mm: 1; SizeX_mm: 1.6; SizeY_mm: 0.8; Cap_Case: 0603; Value2: 100V; SizeArea_mm2: 1.28; CompType: Capacitor; Cap_F: 100nF; AEC Category: Q200; Supplier Part Number 2: 81-GRM188R72A104KA5J; Publisher: Texas Instruments; Supplier 2: Mouser; TempCo: X7R; Published: 2008-06-19; RoHS: Y; MountType: SMT; Supplier 1: Digi-Key; PackageReference: 0603; Tolerance_%: 10%; LatestRevisionDate: 2017-03-09; PartNumber: GRM188R72A104KA35J; AEC Qualified: ?; VDC_V: 100V; ComponentLink1Description: Datasheet link; Supplier Part Number 1: 490-6439-1-ND; Technology: Ceramic; ComponentLink1URL: http://search.murata.co.jp/Ceramy/image/img/A01X/G101/ENG/GRM188R72A104KA35-01.pdf
C36 = T521X336M050ATE075: 33µF Molded Tantalum Polymer Capacitor 50V 2917 (7343 Metric) 75mOhm @ 100kHz; Supplier 1: Digi-Key; Supplier Part Number 1: 399-11721-1-ND
C51 = CMP-0074683-2: CAP, Aluminum Polymer, 220 µF, 6.3 V,+/- 20%, 0.01 ohm, 7343-31 SMD; Manufacturer: MuRata; PartNumber: ECASD60J227M010K00; TaMin_C: -40°C; ESR_ohm: 0.01; Polarized: Y; SizeAreaWB_mm2: 58.59; Value: 220uF; TaMax_C: 105°C; SizeZ_mm: 3.1; SizeX_mm: 7.3; SizeY_mm: 4.3; SizeArea_mm2: 31.39; CompType: Capacitor; AEC Qualified: N; IRMS_A: 3A; AEC Category: Q200; ComponentLink1URL: http://www.murata.com/~/media/webrenewal/support/library/catalog/products/capacitor/polymer/c90e.ashx; Supplier Part Number 2: 11AC3033; Supplier 2: Newark; Supplier Part Number 3: 81-ECASD60J227M010K0; Supplier 3: Mouser; RoHS: Y; Value1: 0.01 ohm; MountType: SMT; Supplier 1: Digi-Key; PackageReference: 7343-31; Tolerance_%: 20%; Cap_Case: 7343-31; Value2: 6.3V; Series: ECAS; Cap_F: 220µF; ComponentLink1Description: Datasheet link; AEC Grade: N/A; Supplier Part Number 1: 490-12529-1-ND; Technology: Aluminum Polymer
C55 = CMP-0009199-2: CAP, CERM, 100 uF, 6.3 V, +/- 20%, X6S, 1210; Manufacturer: MuRata; TaMin_C: -55°C; Polarized: N; SizeAreaWB_mm2: 14.7; Value1: Unknown; U/M: EA; Value: 100uF; TaMax_C: 105°C; SizeZ_mm: 2.7; SizeX_mm: 3.2; SizeY_mm: 2.5; Cap_Case: 1210; Value2: 6.3V; SizeArea_mm2: 8; Cap_F: 100µF; AEC Category: Q200; Supplier Part Number 2: 81-GRM32EC80J107ME0L; Publisher: Texas Instruments; Supplier 2: Mouser; Supplier Part Number 3: 1889302; TempCo: X6S; Supplier 3: Farnell; Published: 2008-06-19; RoHS: Y; MountType: SMT; Supplier 1: Digi-Key; PackageReference: 1210; Tolerance_%: 20%; CompType: Capacitor; LatestRevisionDate: 2017-03-09; PartNumber: GRM32EC80J107ME20L; AEC Qualified: ?; VDC_V: 6.3V; ComponentLink1Description: Datasheet link; Supplier Part Number 1: GRM32EC80J107ME20L-ND; Technology: Ceramic; ComponentLink1URL: http://search.murata.co.jp/Ceramy/PnsearchViewAction.do?HnOFG=ON&HnNFG=ON&SEL_CNT=50&sLang=en&sKey=GRM32EC80J107ME20L&x=9&y=9&search=startwith
C109 = CMP-0007255-4: CAP, CERM, 22 pF, 100 V, +/- 5%, C0G/NP0, 0603; Manufacturer: MuRata; TaMin_C: -55°C; Polarized: N; SizeAreaWB_mm2: 4.68; Value1: Unknown; U/M: EA; Value: 22pF; TaMax_C: 125°C; SizeZ_mm: 1; SizeX_mm: 1.6; SizeY_mm: 0.8; Cap_Case: 0603; Value2: 100V; SizeArea_mm2: 1.28; CompType: Capacitor; AEC Category: Q200; Supplier Part Number 2: 81-GRM1885C2A220JA01; Supplier 2: Mouser; TempCo: C0G/NP0; RoHS: Y; MountType: SMT; Supplier 1: Digi-Key; PackageReference: 0603; Tolerance_%: 5%; PartNumber: GRM1885C2A220JA01D; AEC Qualified: ?; Cap_F: 22pF; VDC_V: 100V; ComponentLink1Description: Datasheet link; Supplier Part Number 1: 490-1335-1-ND; Technology: Ceramic; ComponentLink1URL: http://search.murata.co.jp/Ceramy/PnsearchViewAction.do?HnOFG=ON&HnNFG=ON&SEL_CNT=50&sLang=en&sKey=GRM1885C2A220JA01D&x=9&y=9&search=startwith; Publisher: Texas Instruments; Published: 2008-06-19; LatestRevisionDate: 2017-03-09
C112 = CMP-0007141-5: CAP, CERM, 0.047 uF, 25 V, +/- 10%, X7R, AEC-Q200 Grade 1, 0603; Manufacturer: MuRata; TaMin_C: -55°C; Polarized: N; SizeAreaWB_mm2: 4.68; Value1: Unknown; U/M: EA; TaMax_C: 125°C; SizeZ_mm: 1; SizeX_mm: 1.6; SizeY_mm: 0.8; Cap_Case: 0603; SizeArea_mm2: 1.28; CompType: Capacitor; AEC Qualified: Y; Cap_F: 47nF; AEC Category: Q200; Supplier Part Number 2: 81-GCM188R71E473KA7D; Publisher: Texas Instruments; Supplier 2: Mouser; TempCo: X7R; Published: 2008-06-19; RoHS: Y; MountType: SMT; Value: 0.047uF; Supplier 1: Digi-Key; PackageReference: 0603; Tolerance_%: 10%; Value2: 25V; LatestRevisionDate: 2017-03-09; PartNumber: GCM188R71E473KA37D; ComponentLink1Description: Datasheet link; Supplier Part Number 1: 490-8018-1-ND; Technology: Ceramic; ComponentLink1URL: http://psearch.murata.com/capacitor/product/GCM188R71E473KA37%23.pdf; AEC Grade: 1
D7 = CMP-0028855-1: Diode, Schottky, 40 V, 3 A, AEC-Q101, SMAF; PartNumber: FSV340AF; Manufacturer: Fairchild Semiconductor; SizeAreaWB_mm2: 19.95; SizeArea_mm2: 11.75; AEC Qualified: Y; TJmax_C: 150°C; AEC Category: Q101; SizeZ_mm: 1; Green_REACh: Incomplete; Io_A: 3A; Vf_V: 5dV; SizeY_mm: 2.5; Value2: 0.5V; Green_Lifecycle: Not Set; U/M: EA; SizeX_mm: 4.7; ComponentLink1Description: Datasheet link; RoHS: Y; Supplier 1: Digi-Key; Vr_V: 40V; Green_EU RoHS: Incomplete; PackageReference: SMAF; Value: 40V; Publisher: Texas Instruments; Supplier Part Number 2: 512-FSV340AF; Supplier 2: Mouser; Published: 2008-06-26; LatestRevisionDate: 2017-05-08; ComponentLink1URL: https://www.fairchildsemi.com/datasheets/FS/FSV330AF.pdf; Value1: 3A; CompType: Diode; MountType: SMT; Supplier Part Number 1: FSV340AFCT-ND; Type: Schottky; Green_EU RoHS-2: Incomplete
D8 = CMP-0005415-2: Diode, Zener, 24 V, 1 W, PowerDI123; Manufacturer: Diodes Inc.; Power_W: 1W; SizeAreaWB_mm2: 13.066; RJA_CperW: 110; U/M: EA; Value: 24V; SizeZ_mm: 0.98; SizeX_mm: 3.7; SizeY_mm: 1.78; SizeArea_mm2: 6.586; AEC Category: Q101; Supplier Part Number 2: 621-DFLZ24-7; Publisher: Texas Instruments; Supplier 2: Mouser; Supplier Part Number 3: 2077975; Supplier 3: Farnell; Published: 2008-10-08; RoHS: Y; Value1: 1W; MountType: SMT; Supplier 1: Digi-Key; LatestRevisionNote: Updated Supplier Data; PackageReference: PowerDI123; CompType: Zener; LatestRevisionDate: 2017-03-09; PartNumber: DFLZ24-7; AEC Qualified: ?; ComponentLink1Description: Datasheet link; Supplier Part Number 1: DFLZ24DICT-ND; ComponentLink1URL: http://www.diodes.com/datasheets/ds30464.pdf
D15 = CMP-0005855-1: Diode, Zener, 5.6 V, 200 mW, SOD-323; Manufacturer: Diodes Inc.; Power_W: 200mW; SizeAreaWB_mm2: 8.695; Value1: 0.2W; RJA_CperW: 350; U/M: EA; Value: 5.6V; SizeZ_mm: 1; SizeX_mm: 2.7; SizeY_mm: 1.35; SizeArea_mm2: 3.645; AEC Category: Q101; ComponentLink1URL: http://www.diodes.com/datasheets/ds31038.pdf; Supplier Part Number 2: 621-MMSZ5232BS-F; Publisher: Texas Instruments; Supplier 2: Mouser; Published: 2008-10-08; RoHS: Y; MountType: SMT; Supplier 1: Digi-Key; LatestRevisionNote: Updated Supplier Data; PackageReference: SOD-323; CompType: Zener; LatestRevisionDate: 2017-03-09; PartNumber: MMSZ5232BS-7-F; AEC Qualified: ?; ComponentLink1Description: Datasheet link; Supplier Part Number 1: MMSZ5232BS-FDICT-ND
D16 = CMP-0029019-1: Diode, Ultrafast, 75 V, 0.25 A, SOD-323; Manufacturer: Central Semiconductor; PartNumber: CMDD4448; Io_A: 2.5dA; Green_Lifecycle: Not Set; SizeAreaWB_mm2: 8.695; Green_REACh: Incomplete; Value1: 0.25A; TJmax_C: 175°C; U/M: EA; SizeZ_mm: 1; SizeX_mm: 2.7; SizeY_mm: 1.35; Vf_V: 1.2V; SizeArea_mm2: 3.645; AEC Category: Q101; ComponentLink1URL: http://www.centralsemi.com/PDFs/products/CMDD4448.PDF; Publisher: Texas Instruments; Vr_V: 75V; Published: 2008-06-26; RoHS: Y; MountType: SMT; Green_EU RoHS-2: Incomplete; Value: 75V; Green_EU RoHS: Incomplete; PackageReference: SOD-323; Value2: 1.2V; CompType: Diode; Type: Ultrafast; LatestRevisionDate: 2017-05-08; AEC Qualified: ?; ComponentLink1Description: Datasheet link
L1 = CMP-0003072-1: Ferrite Bead, 22 ohm @ 100 MHz, 6 A, 0805; Manufacturer: Wurth Elektronik; Ztyp@1GHz_Ohm: 40.219; ZTyp@100MHz_Ohm: 22; SizeAreaWB_mm2: 6.75; DCR_ohm: 8m; Value1: 0.008 ohm; Value: 22 ohm; Imax_A: 6A; SizeZ_mm: 1.45; SizeX_mm: 2; SizeY_mm: 1.25; SizeArea_mm2: 2.5; ComponentLink1URL: http://katalog.we-online.de/pbs/datasheet/742792021.pdf; Supplier Part Number 2: 710-742792021; Publisher: Texas Instruments; Supplier 2: Mouser; Published: 2014-04-30; RoHS: Y; MountType: SMT; Supplier 1: Digi-Key; PackageReference: 0805; Value2: 6A; CompType: Ferrite Bead; LatestRevisionDate: 2017-03-09; PartNumber: 742792021; ComponentLink1Description: Datasheet link; Supplier Part Number 1: 732-4637-1-ND; ValueDisplayed: 22 ohm
L2 = CMP-0063804-1: Inductor, Shielded Drum Core, Ferrite, 10 uH, 1 A, 0.12 ohm, SMD; Manufacturer: Wurth Elektronik; Isat: 1A @ 35% inductance drop; Irms: 1.3A @ 30C rise; Green_Lifecycle: Active; SizeAreaWB_mm2: 33.64; DCR_ohm: 1.2d; Green_REACh: Passed; Value: 10uH; Imax_A: 1A; SizeZ_mm: 1.8; SizeX_mm: 4.8; SizeArea_mm2: 23.04; Ind_H: 10µH; AEC Category: Q200; PackageReference: WE-TPC-M1; ComponentLink1Description: Datasheet link; ComponentLink1URL: http://www.we-online.com/eisos/pdf/744042100.pdf; Supplier Part Number 2: 710-744042100; Publisher: Texas Instruments; Supplier 2: Mouser; Supplier Part Number 3: 1635842; Supplier 3: Farnell; Published: 2008-06-26; RoHS: Y; Value1: 0.12 ohm; Material: Ferrite; MountType: SMT; Green_EU RoHS-2: Incomplete; Supplier 1: Digi-Key; Green_EU RoHS: Passed; SizeY_mm: 4.8; Value2: 1A; CompType: Inductor; LatestRevisionDate: 2017-06-02; PartNumber: 744042100; AEC Qualified: ?; Supplier Part Number 1: 732-1025-1-ND; Technology: Shielded Drum Core
R3 = CMP-0022036-4: RES, 130 k, 1%, 0.1 W, AEC-Q200 Grade 0, 0603; Manufacturer: Vishay-Dale; Power_W: 100mW; TempCo: 100 ppm/C; Value: 130k; EIA_Code: E96; SizeX_mm: 1.6; SizeY_mm: 0.8; SizeZ_mm: 1; Value2: 0.1W; SizeArea_mm2: 1.28; CompType: Resistor; AEC Qualified: Y; VDC_V: 75V; AEC Category: Q200; AEC Grade: 0; Supplier Part Number 2: 52K8127; Supplier 2: Newark; Supplier Part Number 3: 71-CRCW0603-130K-E3; Supplier 3: Mouser; Value_Code: 130k; RoHS: E; Value1: 1%; MountType: SMT; Supplier 1: Digi-Key; PackageReference: 0603; Tolerance_%: 1%; Res_ohm: 130k; PartNumber: CRCW0603130KFKEA; ComponentLink1Description: Datasheet link; Supplier Part Number 1: 541-130KHCT-ND; Technology: Thick Film; ComponentLink1URL: http://www.vishay.com/docs/20035/dcrcwe3.pdf
R93 R94 = CMP-0021991-3: RES, 100, 1%, 0.1 W, 0603; Manufacturer: Vishay-Dale; Power_W: 100mW; TempCo: 100 ppm/C; Value_Code: 100R; U/M: EA; Value: 100; EIA_Code: E96; SizeX_mm: 1.6; SizeY_mm: 0.8; SizeZ_mm: 1; Value2: 0.1W; SizeArea_mm2: 1.28; CompType: Resistor; VDC_V: 75V; AEC Category: Q200; Supplier Part Number 2: 52K8078; Publisher: Texas Instruments; Supplier 2: Newark; Supplier Part Number 3: 71-CRCW0603-100-E3; Supplier 3: Mouser; Published: 2008-06-26; RoHS: Y; Value1: 1%; MountType: SMT; Supplier 1: Digi-Key; PackageReference: 0603; Tolerance_%: 1%; Res_ohm: 100; LatestRevisionDate: 2017-03-09; PartNumber: CRCW0603100RFKEA; AEC Qualified: ?; ComponentLink1Description: Datasheet link; Supplier Part Number 1: 541-100HCT-ND; Technology: Thick Film; ComponentLink1URL: http://www.vishay.com/docs/20035/dcrcwe3.pdf
R95 = CMP-0022064-4: RES, 158 k, 1%, 0.1 W, AEC-Q200 Grade 0, 0603; Manufacturer: Vishay-Dale; Power_W: 100mW; TempCo: 100 ppm/C; Value: 158k; EIA_Code: E96; SizeX_mm: 1.6; SizeY_mm: 0.8; SizeZ_mm: 1; Value2: 0.1W; SizeArea_mm2: 1.28; CompType: Resistor; AEC Qualified: Y; VDC_V: 75V; AEC Category: Q200; AEC Grade: 0; ComponentLink1URL: http://www.vishay.com/docs/20035/dcrcwe3.pdf; Supplier Part Number 2: 52K8164; Supplier 2: Newark; Supplier Part Number 3: 71-CRCW0603-158K-E3; Supplier 3: Mouser; Value_Code: 158k; RoHS: E; Value1: 1%; MountType: SMT; Supplier 1: Digi-Key; PackageReference: 0603; Tolerance_%: 1%; Res_ohm: 158k; PartNumber: CRCW0603158KFKEA; ComponentLink1Description: Datasheet link; Supplier Part Number 1: 541-158KHCT-ND; Technology: Thick Film
R96 = CMP-0022030-3: RES, 12.1 k, 1%, 0.1 W, 0603; Manufacturer: Vishay-Dale; Power_W: 100mW; TempCo: 100 ppm/C; Value_Code: 12k1; U/M: EA; Value: 12.1k; EIA_Code: E96; SizeX_mm: 1.6; SizeY_mm: 0.8; SizeZ_mm: 1; Value2: 0.1W; SizeArea_mm2: 1.28; CompType: Resistor; VDC_V: 75V; AEC Category: Q200; Supplier Part Number 2: 52K8105; Publisher: Texas Instruments; Supplier 2: Newark; Supplier Part Number 3: 71-CRCW0603-12.1K-E3; Supplier 3: Mouser; Published: 2008-06-26; RoHS: Y; Value1: 1%; MountType: SMT; Supplier 1: Digi-Key; PackageReference: 0603; Tolerance_%: 1%; LatestRevisionDate: 2017-03-09; PartNumber: CRCW060312K1FKEA; AEC Qualified: ?; ComponentLink1Description: Datasheet link; Supplier Part Number 1: 541-12.1KHCT-ND; Technology: Thick Film; Res_ohm: 12.1k; ComponentLink1URL: http://www.vishay.com/docs/20035/dcrcwe3.pdf
T8 = CMP-0085524-1: Transformer, 30 uH, SMD; Manufacturer: Coilcraft; SizeAreaWB_mm2: 137.86; SizeArea_mm2: 94.86; AEC Qualified: N; Lp: 30; AEC Category: Q200; Value: 30uH; SizeZ_mm: 10.6; Ind_H: 30µH; SizeY_mm: 10.2; Ns1toNp: 0.33; Rsec1_ohm: 0.025; DCR_ohm: 0.014; SizeX_mm: 9.3; LeakageInd_H: 380nH; ComponentLink1Description: Datasheet URL; RoHS: Y; PackageReference: 9.3x10.2mm; PartNumber: YA8779-BL; AEC Grade: N/A; ComponentLink1URL: https://sps16.itg.ti.com/sites/KMS/crossdivteams/altium/docs/ComponentDatasheets/YA8779-BL -- 5V single output.pdf; CompType: Transformer; MountType: SMT; ValueDisplayed: 30µH; Ns2toNp: 0.33; Rsec2_ohm: 0.025
TP2-TP4 = CMP-0055152-1: Test Point, Miniature, SMT; Manufacturer: Keystone; PartNumber: 5015; CNHeader: FALSE; Green_Lifecycle: Active; Green_REACh: Passed; CT: TRUE; ComponentLink1URL: http://www.keyelco.com/userAssets/store/files/5015.PDF; Supplier Part Number 2: 534-5015; Publisher: Texas Instruments; Supplier 2: Mouser; RoHS: Y; MountType: SMT; Green_EU RoHS-2: Incomplete; Supplier 1: Digi-Key; Green_EU RoHS: Passed; PackageReference: Testpoint_Keystone_Miniature; CompType: Test Point; LatestRevisionDate: 26/05/2017; ComponentLink1Description: Datasheet URL; Supplier Part Number 1: 36-5015TR-ND
U10 = CMP-0078633-2: 70-V PSR Flyback Converter With 100-V, 1.2-A Power Switch and Ultra-Low IQ, NGU0008C (WSON-8); Alternate PartNumber: LM5180QNGUTQ1; Alternate Manufacturer: Texas Instruments; Alternate Manufacturer: None; SizeAreaWB_mm2: 25; SizeZ_mm: 0.8; SizeX_mm: 4; SizeArea_mm2: 16; CompType: IC; AEC Qualified: Y; AEC Category: Q200; ComponentLink1URL: http://www.ti.com/lit/ds/symlink/lm5180-q1.pdf; PackageDescription: WSON-8; MountType: SMT; ComponentLink2URL: http://www.ti.com/product/lm5180-q1; ComponentLink2Description: Product Folder; Manufacturer: Texas Instruments; PackageReference: NGU0008C; SizeY_mm: 4; PartNumber: LM5180QNGURQ1; ComponentLink1Description: Datasheet Link

## Sheet isolated_dcdc_3.3to3.3.SchDoc
size A4
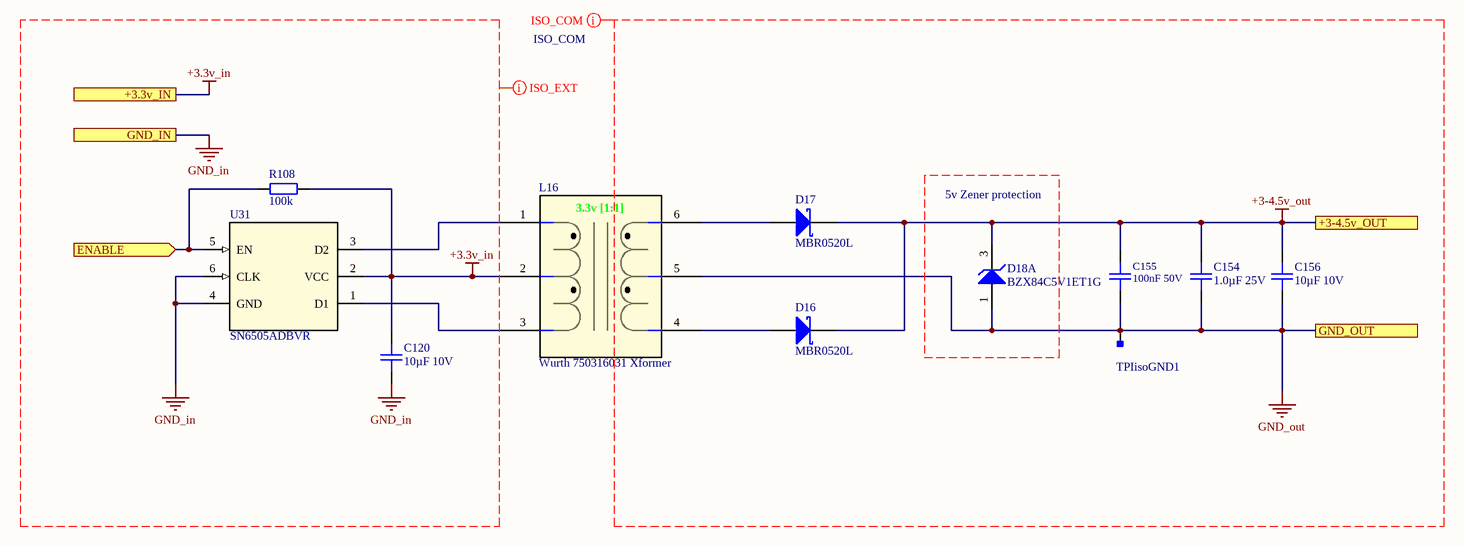
[diagram p4: isolated_dcdc_3.3to3.3.SchDoc]

### Parts
C120  10µF 10V  [0805C]
C154  1.0µF 25V  [0603C]
C155  100nF 50V  [0603C]
C156  10µF 10V  [0805C]
D16  MBR0520L  [ONSC-SOD-123-2-425-04_V]
D17  MBR0520L  [ONSC-SOD-123-2-425-04_V]
D18  BZX84C5V1ET1G  [ONSC-SOT-23-3-318-08_V]  (part A of 2)
L16  Wurth 750316031 Xformer  [750316031]
R108  100k  [0603R]
TPIisoGND1  Testpoint_Square  [Testpoint_S1]  (value not drawn)  (no BOM)
U31  SN6505ADBVR  [DBV0006A_N]

### Ports
+3-4.5v_OUT, +3.3v_IN, ENABLE (in), GND_IN, GND_OUT

### Nets
+3-4.5v_out: C154.2 C155.2 C156.2 D16.1(K) D17.1(K) D18.3(K) ; port +3-4.5v_OUT
+3.3v_in: C120.2 L16.2 R108.2 U31.2(VCC) ; port +3.3v_IN  [project net +3.3V_COM]
GND_in: C120.1 C154.1 C155.1 C156.1 D18.1(A) L16.5 TPIisoGND1.1 U31.4(GND) U31.6(CLK) ; port GND_IN, port GND_OUT  [also labelled GND_out]  [project net GND]
COM_EXT_ISO_EN: R108.1 U31.5(EN) ; port ENABLE
NetD16_2: D16.2(A) L16.4
NetD17_2: D17.2(A) L16.6
NetL16_1: L16.1 U31.3(D2)
NetL16_3: L16.3 U31.1(D1)

### Layout directives
net class ISO_COM: +3-4.5v_out, GND_out
net class ISO_EXT: +3.3v_in, GND_in

### Notes on the sheet
- 5v Zener protection
- (in symbol 750316031) 3.3v [1:1]

### Library data of the parts
C120 C156 = gen_C_ceramic_10u_10V_X7R_0805: Ceramic, 10µF, ±10%, 10V, X7R, –55 to 125°C, 0805 (2012),RoHS, Automotive; Part Number: GCJ21BR71A106KE01; Manufacturer: Murata; Case EIA: 0805; Case Metric: 2012; Automotive Qualified: True; PnP Package: C_0805_10; PnP Value: 10µF/10V/X7R; Capacitance: 10µF; Dielectric: X7R; Rated Voltage: 10V; Height - Seated (Max): 1.25mm; Mounting Type: SurfaceMount,MLCC; Operating Temperature: –55 to 125°C; Series: GCJ; Tolerance: ±10%; Manufacturer_Part_Number: GCJ21BR71A106KE01; Supplier 1: Digi-Key; Supplier Part Number 1: 490-12646-1-ND
C154 = gen_C_ceramic_1u_25V_X7R_0603: Ceramic, 1.0µF, ±10%, 25V, X7R, –55 to 125°C, 0603 (1608),RoHS, Automotive; Part Number: GCJ188R71E105KA01; Manufacturer: Murata; Case EIA: 0603; Case Metric: 1608; Capacitance: 1µF; Automotive Qualified: True; PnP Package: C_0603_10; PnP Value: 1.0µF/25V/X7R; Dielectric: X7R; Rated Voltage: 25V; Height - Seated (Max): 0.8mm; Mounting Type: SurfaceMount,MLCC; Operating Temperature: –55 to 125°C; Series: GCJ; Tolerance: ±10%; Manufacturer_Part_Number: GCJ188R71E105KA01; Supplier 1: Digi-Key; Supplier Part Number 1: 490-14409-1-ND
C155 = gen_C_ceramic_100n_50V_X7R_0603: as C107 on sheet supply_internal; Dielectric: X7R; Rated Voltage: 50V; Height - Seated (Max): 0.8mm; Mounting Type: SurfaceMount,MLCC; Operating Temperature: –55 to 125°C; Series: GCJ; Tolerance: ±10%; Manufacturer_Part_Number: GCJ188R71H104KA12; Supplier 1: Digi-Key; Supplier Part Number 1: 490-5798-1-ND
D16 D17 = CMP-2000-04926-1: Schottky Diode, 20V, 0.2A, 2-pin SOD-123, RoHS, Tape and Reel; Manufacturer: FairchildSemiconductor; Peak Forward Voltage: 0.385V; Rad Hard: No; Peak Non-Repetitive Surge Current: 5.5A; Peak Average Forward Current: 0.5A; Peak Reverse Current: 250uA; Configuration: Single; Mounting: SurfaceMount; Operating Temperature: -65to125degC; Datasheet URL: https://datasheet.ciiva.com/5739/1684450-5739282.pdf; Package Reference: SOD-123-2-425-04; Package Description: 2-Pin Small Outline Diode, Body 2.69 x 1.6 mm; Type: SchottkyDiode; Datasheet Version: Rev. C0, 03/2012; Manufacturer URL: https://www.fairchildsemi.com/; Peak Reverse Repetitive Voltage: 20V; Package: 2SOD-123; Packaging: Tape&Reel; Category: Rectifier
D18 = CMP-1060-00940-1: Zener Voltage Regulator, 225 mW, 3-Pin SOT-23, Pb-Free, Tape and Reel; Manufacturer: On Semiconductor; PackageReference: SOT-23-3-318-08; Mounting Technology: Surface Mount; ComponentLink2URL: http://www.onsemi.com/pub_link/Collateral/BZX84C2V4ET1-D.PDF; PackageVersion: Rev. AP, 11/2009; PartNumber: BZX84C5V1ET1G; Packing: Tape and Reel; ComponentLink3URL: http://www.onsemi.cn/pub_link/Collateral/318-08.PDF; RoHS: Pb-Free; ComponentLink2Description: Datasheet; ComponentLink1Description: Manufacturer URL; DatasheetVersion: Rev. 8; ComponentLink3Description: Package Specification; ComponentLink1URL: http://www.onsemi.com/; PackageDescription: 3-Pin Small Outline Transistor, Body 2.92 x 1.3 mm, Pitch 0.95 mm; PartId: 1
L16 = 750316031: Isolated interface power supply for CAN, RS-485, RS-422, RS-232, SPI, I2C, lower-power LAN 1:1 1A; Manufacturer_Part_Number: 50225C; Vendor: Murata; Built_By: EMA_UL_Team; Type: DEV; Copyright: Copyright (C) 2018 Accelerated Designs. All rights reserved; RefDes: RefDes; Value: Value
R108 = gen_R_100k_0603: as R104 on sheet supply_internal; Operating Temperature: -55°C - +155°C; PnP Value: 100k; Part Number: gen_R_100k_0603
TPIisoGND1 = Testpoint_Square: Testpoint, square; Part Number: Testpoint_Square
U31 = SN6505ADBVR: Imported; Alternate_PartNumber: SN6505ADBVT; Manufacturer: Texas Instruments; CompType: IC; PIN_COUNT: 6; Application_BuildNumber: *; PartNumber: SN6505ADBVR; PackageReference: DBV0006A; MountType: SMT; RefDes: RefDes; TYPE: TYPE; Value: Value